# EAGLE design LeakMonitorMonitor (EAGLE 9.1.3)
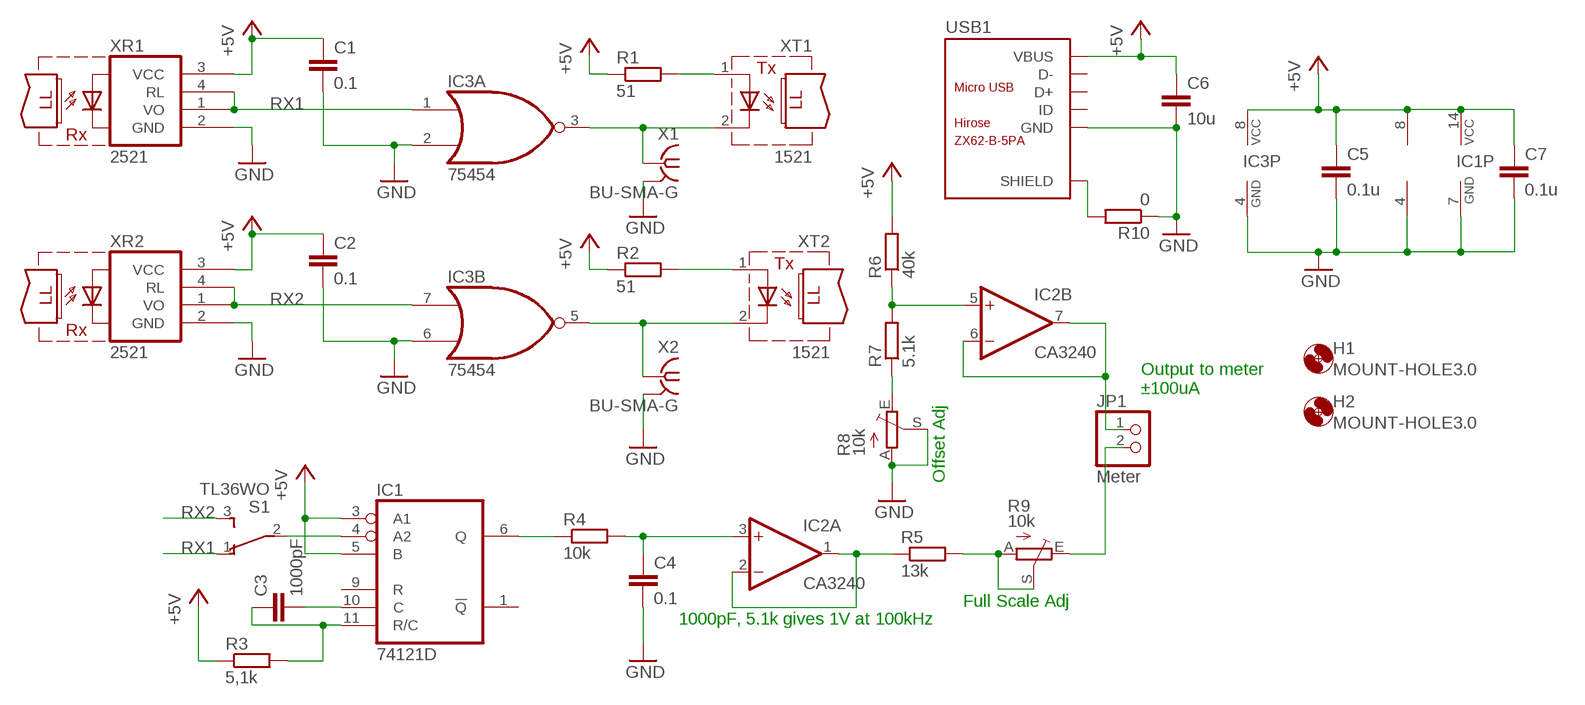
[diagram p0: schematic, sheet 1]

## Parts
C1  0.1  C-EUC0805  [C0805]
C2  0.1  C-EUC0805  [C0805]
C3  1000pF  C-EUC0805  [C0805]
C4  0.1  C-EUC0805  [C0805]
C5  0.1u  C-EUC0805  [C0805]
C6  10u  C-EUC1206  [C1206]
C7  0.1u  C-EUC0805  [C0805]
H1  MOUNT-HOLE3.0  [3,0]
H2  MOUNT-HOLE3.0  [3,0]
IC1  74121D  [SO14]
IC2  CA3240  CA3240ED  [SO08]
IC3  75454  SN75454BD  [D_R-PDSO-G8]
JP1  Meter  PINHD-1X2  [1X02]
R1  51  R-EU_M0805  [M0805]
R2  51  R-EU_M0805  [M0805]
R3  5,1k  R-EU_M0805  [M0805]
R4  10k  R-EU_M0805  [M0805]
R5  13k  R-EU_M0805  [M0805]
R6  40k  R-EU_M0805  [M0805]
R7  5.1k  R-EU_M0805  [M0805]
R8  10k  TRIM_EU-B25X  [B25X]
R9  10k  TRIM_EU-B25X  [B25X]
R10  0  R-EU_R0805  [R0805]
S1  TL36WO  [TL3XWO]
USB1  ZX62-B-5PA  MICRO-USB-SMD(ZX62-B-5PA)  [MICRO-USB5+6P-SMD-0.65-AB]
X1  BU-SMA-G  [BU-SMA-G]
X2  BU-SMA-G  [BU-SMA-G]
XR1  2521  HFBR-2521  [HFBR-15X3]
XR2  2521  HFBR-2521  [HFBR-15X3]
XT1  1521  HFBR-1521  [HFBR-15X3]
XT2  1521  HFBR-1521  [HFBR-15X3]

## Nets
+5V: C1.1 C2.1 C5.1 C6.1 C7.1 IC1.3(A1) IC1.5(B) IC1.14(VCC) IC2.8(P:V+) IC3.8(P:VCC) R1.1 R2.1 R3.1 R6.2 USB1.1(VBUS) XR1.3(VCC) XR2.3(VCC)
GND: C1.2 C2.2 C4.2 C5.2 C6.2 C7.2 IC1.7(GND) IC2.4(P:V-) IC3.2(A:I1) IC3.4(P:GND) IC3.6(B:I1) R8.A R8.S R10.1 USB1.5(GND) X1.2 X1.3 X1.4 X1.5 X2.2 X2.3 X2.4 X2.5 XR1.2(GND) XR2.2(GND)
N$1: IC3.3(A:O) X1.1 XT1.2(C)
N$2: IC2.5(B:+IN) R6.1 R7.2
N$3: R7.1 R8.E
N$4: IC3.5(B:O) X2.1 XT2.2(C)
N$5: R2.2 XT2.1(A)
N$6: R1.2 XT1.1(A)
N$7: C3.2 IC1.10(C)
N$8: IC2.1(A:OUT) IC2.2(A:-IN) R5.1
N$9: R5.2 R9.A R9.S
N$10: JP1.2 R9.E
N$11: IC2.6(B:-IN) IC2.7(B:OUT) JP1.1
N$12: C3.1 IC1.11(R/C) R3.2
N$13: IC1.6(Q) R4.1
N$14: C4.1 IC2.3(A:+IN) R4.2
N$16: IC1.4(A2) S1.2(P)
RX1: IC3.1(A:I0) S1.1(O) XR1.1(VO) XR1.4(RL)
RX2: IC3.7(B:I0) S1.3(S) XR2.1(VO) XR2.4(RL)
SHIELD: R10.2 USB1.P1(SHIELD) USB1.P2(SHIELD) USB1.P3(SHIELD) USB1.P4(SHIELD) USB1.P5(SHIELD) USB1.P6(SHIELD)
Unconnected: IC1.1(!Q) IC1.9(R) USB1.2(D-) USB1.3(D+) USB1.4(ID)

## Notes on the sheet
- Output to meter
  ±100uA
- Offset Adj
- Full Scale Adj
- 1000pF, 5.1k gives 1V at 100kHz

## Library data of the parts
C1-C7 = rcl:C-EU: CAPACITOR, European symbol; SPICEPREFIX: C
H1 H2 = holes:MOUNT-HOLE: MOUNTING HOLE with drill center marker
IC1 = 74xx-eu:74*121: Monostable MULTIVIBRATOR, schmitt trigger inputs
IC2 = linear:CA3240E: OP AMP
IC3 = texas-sn55-sn75:SN75454B: NOR PERIPHERAL DRIVERS FOR HIGH-CURRENT SWITCHING AT VERY HIGH SPEEDS Source: www.ti.com sn75452b.pdf
JP1 = pinhead:PINHD-1X2: PIN HEADER
R1-R7 R10 = rcl:R-EU_: RESISTOR, European symbol; SPICEPREFIX: R
R8 R9 = pot:TRIM_EU-: POTENTIOMETER
S1 = switch:TL36WO: TINY SWITCH ON - ON Source: http://www2.produktinfo.conrad.com/datenblaetter/700000-724999/705152-da-01-de-Subminiaturschalter_TL_36WO.pdf
USB1 = Seeed-Connector:MICRO-USB-SMD(ZX62-B-5PA): 320010005; MPN: ZX62-B-5PA
X1 X2 = con-coax:BU-SMA-G: FEMALE SMA CONNECTOR Radiall distributor RS 193-9117; OC_FARNELL: unknown; OC_NEWARK: unknown
XR1 XR2 = fiber-optic-hp:HFBR-2521: RECEIVER 5-MBd high performance link, horizontal; MF: AGILENT TECHNOLOGIES; MPN: HFBR-2521; OC_FARNELL: 1173131; OC_NEWARK: 06F6091
XT1 XT2 = fiber-optic-hp:HFBR-1521: TRANSMITTER low cost miniature fiber optic component, 5-MBd high performance link, vertical; MF: AGILENT TECHNOLOGIES; MPN: HFBR-1521; OC_FARNELL: 1173128; OC_NEWARK: 06F6050

## Net classes
0 default: width 0.305 mm

## Board
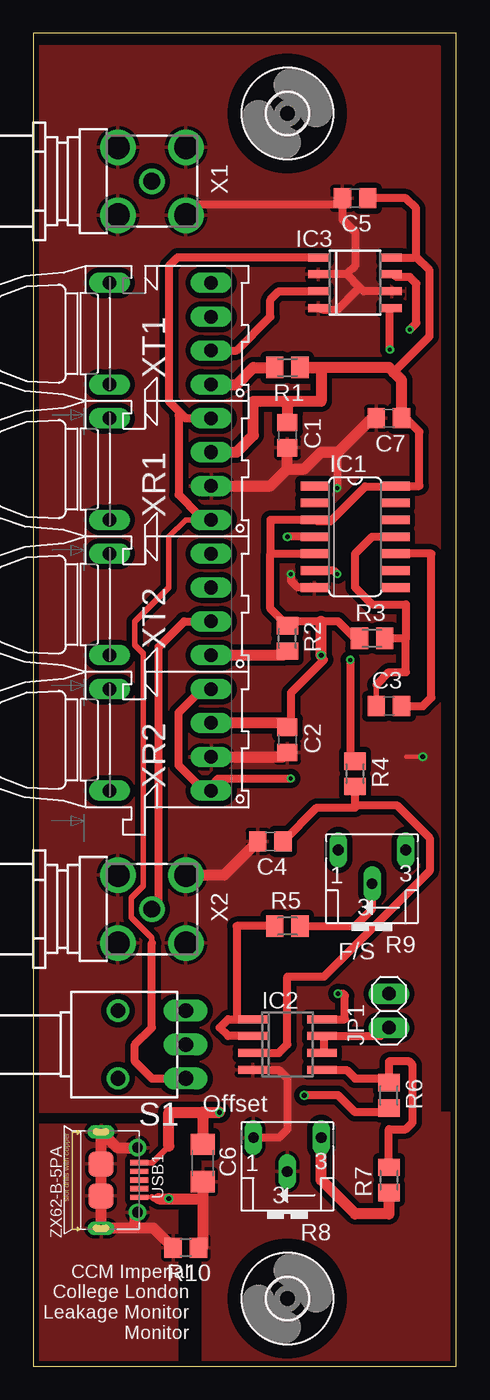
[diagram p1: board, top side]
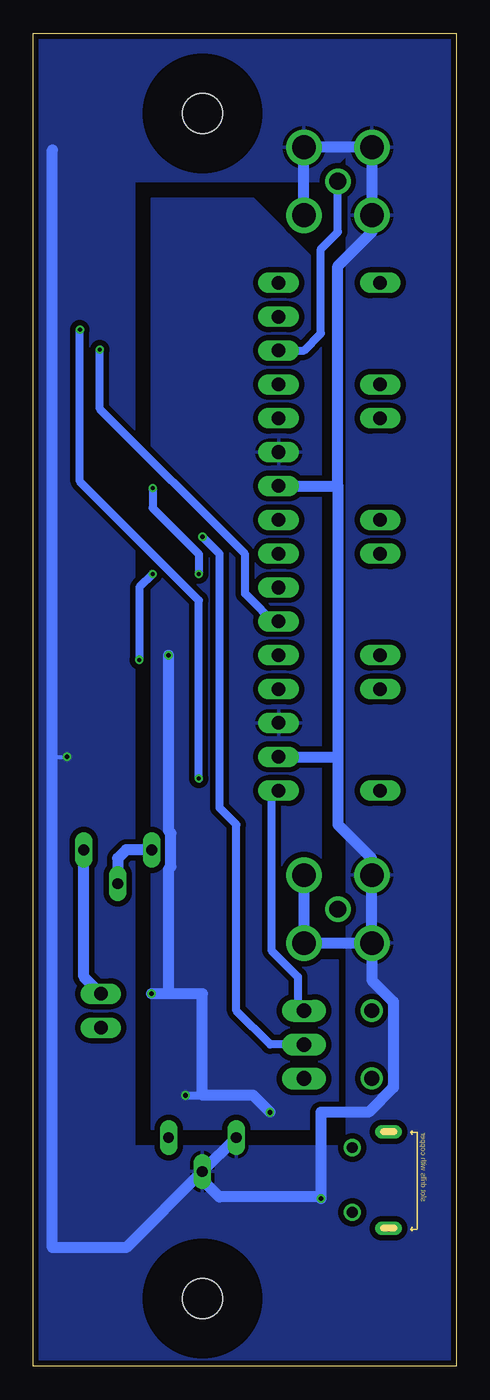
[diagram p2: board, bottom side, seen from below]

Size 31.73 x 100 mm. Coordinates in mm from the lower left corner, seen from the top.
Outline: 0,0 31.73,0 31.73,100 0,100 0,0
Copper layers (1*16): Top 0.035mm / dielectric 1.5mm / Bottom 0.035mm
Design rules "dirt_cheap_dirty_boards.v1 *": minimum track width 12mil, minimum drill 12mil, track to track 15mil, track to pad 15mil, pad to pad 5mil, via to via 5mil, smd to smd 0mil, copper to edge 10mil, drill to drill 10mil, minimum pad ring 10mil, minimum via ring 6mil, stop-mask expansion 2mil, vias tented up to drill 25mil, thermal gap 10mil

### Footprints (pad centres in the part's own frame; a part is rotated, then mirrored left to right if it is on the bottom)
C0805 = smd 1.3 x 1.5: 1 -0.95,0; 2 0.95,0
C1206 = smd 1.6 x 1.8: 1 -1.4,0; 2 1.4,0
3,0 = hole 3: 0,0
SO14 = smd 0.66 x 2.032: 1 -3.81,-3.073; 2 -2.54,-3.073; 3 -1.27,-3.073; 4 0,-3.073; 5 1.27,-3.073; 6 2.54,-3.073; 7 3.81,-3.073; 8 3.81,3.073; 9 2.54,3.073; 10 1.27,3.073; 11 0,3.073; 12 -1.27,3.073; 13 -2.54,3.073; 14 -3.81,3.073
SO08 = smd 0.6 x 2.2: 1 -1.905,-2.6; 2 -0.635,-2.6; 3 0.635,-2.6; 4 1.905,-2.6; 5 1.905,2.6; 6 0.635,2.6; 7 -0.635,2.6; 8 -1.905,2.6
D_R-PDSO-G8 = smd 0.6 x 1.5: 1 -1.905,-2.75; 2 -0.635,-2.75; 3 0.635,-2.75; 4 1.905,-2.75; 5 1.905,2.75; 6 0.635,2.75; 7 -0.635,2.75; 8 -1.905,2.75
1X02 = drill 1.016 long: 1 -1.27,0; 2 1.27,0
M0805 = smd 1.3 x 1.6: 1 -0.95,0; 2 0.95,0
B25X = drill 0.813 long: A 2.54,-1.905; E -2.54,-1.905; S 0,0.635
R0805 = smd 1.3 x 1.5: 1 -0.95,0; 2 0.95,0
TL3XWO = drill 1.1 pad 1.422 long: 1 -2.54,-5.08; 2 0,-5.08; 3 2.54,-5.08 | drill 1.1 pad 1.676: M1 -2.54,0; M2 2.54,0
MICRO-USB5+6P-SMD-0.65-AB = smd 0.4 x 1.35: 1 -1.3,2.875; 2 -0.65,2.875; 3 0,2.875; 4 0.65,2.875; 5 1.3,2.875 | smd 1.9 x 1.9: P1 -1.2,0; P2 1.2,0 | drill 0.508 pad 1.016 long: P3 -3.625,0; P4 3.625,0 | drill 0.8: P5 -2.425,2.73; P6 2.425,2.73
BU-SMA-G = drill 1.27: 1 0,0 | drill 1.778: 2 -2.55,2.55; 3 2.55,2.55; 4 2.55,-2.55; 5 -2.55,-2.55
HFBR-15X3 = drill 1.016 long: 1 3.81,9.525; 2 1.27,9.525; 3 -1.27,9.525; 4 -3.81,9.525; 5 -3.81,1.905; 8 3.81,1.905

### Placement (x,y rotation side)
C1  19.05,69.85 270 top
C2  19.05,46.99 270 top
C3  26.67,49.53 0 top
C4  17.78,39.37 180 top
C5  24.13,87.63 180 top
C6  12.7,15.24 270 top
C7  26.67,71.12 180 top
H1  19.05,5.08 0 top
H2  19.05,93.98 0 top
IC1  24.13,62.23 270 top
IC2  19.05,24.13 270 top
IC3  24.13,81.28 270 top
JP1  26.67,26.67 90 top
R1  19.05,74.93 180 top
R2  19.05,54.61 270 top
R3  25.4,54.61 0 top
R4  24.13,44.45 270 top
R5  19.05,33.02 0 top
R6  26.67,20.32 270 top
R7  26.67,13.97 90 top
R8  19.05,15.24 180 top
R9  25.4,36.83 180 top
R10  11.43,8.89 180 top
S1  6.35,24.13 90 top
USB1  5.08,13.97 270 top
X1  8.89,88.9 180 top
X2  8.89,34.29 180 top
XR1  3.81,67.31 270 top
XR2  3.81,46.99 270 top
XT1  3.81,77.47 270 top
XT2  3.81,57.15 270 top

### Tracks (layer width: path | path; a pad name or v marks a point on that pad's centre or on a via)
+5V  (via drill 0.35)
  Top 0.406: USB1.1 8.92,15.27 10.16,16.51
  Top 0.61: IC3.8 28.57,83.19 | 28.57,83.19 28.7,83.31 28.7,86.87 27.94,87.63 C5.1 | C7.1 27.94,71.12 28.96,70.1 28.96,66.04 IC1.14 27.1,66 24.89,66 22.29,63.4 21.3,63.4 IC1.3 17.78,63.5 17.78,60.96 | R3.1 24.13,54.61 22.86,55.88 21.59,55.88 19.37,55.88 R2.1 17.78,56.83 17.78,60.96 | 17.78,60.96 IC1.5 | IC2.8 23.37,26.04 23.37,27.81 23.24,27.94 v22.86,27.94 | R6.2 26.35,19.05 24.13,19.05 22.86,20.32 v20.32,20.32 | 28.57,83.19 28.73,83.21 29.72,82.22 29.72,77.27 27.24,74.79 27.03,74.57 | C2.1 19.32,48.54 19.32,50.52 21.79,53 v21.59,53.34
  Top 0.813: C2.1 19.05,48.26 XR2.3 | XR1.3 15.24,68.58 16.51,69.85 16.51,72.39 19.05,72.39 | 19.05,72.39 C1.1 | 19.05,72.39 21.59,72.39 21.59,74.93 20.32,74.93 | R1.1 20.32,74.93 | C7.1 27.62,73.98 27.03,74.57 26.67,74.93 20.32,74.93 | 10.16,16.51 10.16,19.05 12.7,19.05 | 12.7,19.05 C6.1 | 12.7,19.05 v13.97,19.05 | v21.59,53.34 21.59,55.88
  Bottom 0.61: v20.32,20.32 19.05,20.32
  Bottom 0.813: v13.97,19.05 15.24,20.32 19.05,20.32 19.05,27.94 21.59,27.94 | 21.59,27.94 v22.86,27.94 | 21.59,27.94 21.59,37.3 21.41,37.48 21.41,39.99 21.59,40.17 v21.59,53.34
  pour Bottom (isolate 0.406): 8.89,17.78 22.86,17.78 22.86,87.63 15.24,87.63 10.16,82.55 10.16,30.48 8.89,30.48
GND  (via drill 0.3, 0.35)
  Top 0.305: USB1.5 7.99,12.7 8.89,12.7 | v29.21,45.72 27.94,45.72
  Top 0.406: 8.89,12.7 9.02,12.57 9.4,12.57
  Top 0.61: IC3.6 24.77,80.64 24.47,80.94 | 23.5,81.92 IC3.2 | 24.47,80.94 23.5,81.92 | 23.5,81.92 24.13,82.55 24.13,85.09 23.18,86.04 C5.2 22.78,87.17 12.38,87.17 11.89,86.68 X1.2 | IC2.4 18.41,22.23 19.05,21.59 19.05,17.78 18.41,17.14 R8.A | IC3.4 21.79,79.25 22.78,79.25 24.27,80.73 24.47,80.94 | v19.32,59.44 19.32,58.94 19.81,58.45 20.8,58.45 IC1.7 | v22.78,65.88 22.78,68.35 22.78,68.58
  Top 0.813: C6.2 12.7,12.7 | 12.7,12.7 12.7,8.89 R10.1 | C4.2 14.29,36.83 X2.5 | XR2.2 18.73,45.72 C2.2 | XR1.2 17.78,66.04 19.05,67.31 | 19.05,67.31 C1.2 | 19.05,67.31 20.32,67.31 21.59,68.58 22.78,68.58 22.86,68.58 25.4,71.12 C7.2 | 9.4,12.57 v10.16,12.57 12.57,12.57 12.7,12.7
  Bottom 0.305: 30.31,45.72 v29.21,45.72
  Bottom 0.61: v19.32,59.44 19.32,60.92 22.78,64.39 v22.78,65.88
  Bottom 0.813: R8.S R8.A | 30.31,91.27 30.31,45.72 30.31,8.89 24.77,8.89 R8.S | X1.3 X1.4 X1.5 X1.2 | X1.3 | XR1.2 8.89,66.04 | 8.89,66.04 8.89,82.55 6.34,85.1 X1.3 | XR2.2 8.89,45.72 | 8.89,45.72 8.89,40.64 6.35,38.1 X2.4 X2.3 | X2.5 X2.2 X2.3 | 8.89,66.04 8.89,45.72 | X2.3 6.34,28.96 4.72,27.34 4.72,20.92 6.59,19.05 10.16,19.05 v10.16,12.57 10.29,12.7 17.78,12.7 19.05,13.97 R8.S
  pour Bottom (isolate 0.406): 0,0 0,99.69 8.26,99.69 8.26,0
  pour Top (isolate 0.406): 0,19.05 0,99.06 30.48,99.06 30.48,19.05
  pour Top (isolate 0.406): 12.7,19.05 31.75,19.05 31.75,0 12.7,0
  pour Bottom (isolate 0.406): 8.38,16.51 31.75,16.51 31.75,0 8.38,0
  pour Bottom (isolate 0.406): 8.26,99.69 31.75,99.69 31.75,88.9 10.16,88.9 8.26,90.81
  pour Bottom (isolate 0.406): 24.13,88.9 31.75,88.9 31.75,16.51 24.13,16.51
N$1
  Top 0.61: XT1.2 15.24,76.2 17.78,78.74 17.78,80.01 18.41,80.64 IC3.3
  Bottom 0.61: XT1.2 11.43,76.2 10.16,77.47 10.16,83.82 8.89,85.09 X1.1
N$2
  Top 0.61: R7.2 26.67,17.78 27.94,17.78 28.45,18.29 28.45,22.61 28.19,22.86 26.67,22.86 R6.1 26.35,21.59 24.13,21.59 23.5,22.23 IC2.5
N$3
  Top 0.813: R7.1 26.67,11.43 24.13,11.43 21.59,13.97 R8.E
N$4  (via drill 0.3)
  Top 0.61: XT2.2 11.3,55.88 9.4,53.98 9.4,34.8 X2.1 | v26.75,76.28 26.75,79.25 IC3.5
  Bottom 0.61: v26.75,76.28 26.75,71.82 15.85,60.92 15.85,57.95 13.37,55.47 XT2.2
N$5
  Top 0.813: R2.2 18.73,53.34 XT2.1
N$6
  Top 0.813: XT1.1 15.24,73.66 16.51,74.93 R1.2
N$7
  Top 0.61: C3.2 29.21,49.53 29.84,50.16 29.84,60.96 IC1.10
N$8
  Top 0.61: IC2.2 14.61,24.77 13.97,25.4 14.61,26.04 15.24,26.04 | 15.24,26.04 IC2.1 | R5.1 15.24,33.02 15.24,26.04
N$9
  Top 0.61: R5.2 24.13,33.02 25.4,34.29 R9.S
  Bottom 0.813: R9.A 24.77,38.73 25.4,38.1 R9.S
N$10
  Bottom 0.813: JP1.2 27.94,29.21 R9.E
N$11
  Top 0.61: IC2.7 21.79,24.77 | 21.79,24.77 26.04,24.77 JP1.1 | 21.79,24.77 21.79,23.77 IC2.6
N$12
  Top 0.406: 25.72,51.12 C3.1
  Top 0.61: IC1.11 25.4,62.23 24.13,60.96 24.13,58.42 25.4,57.15 27.94,57.15 27.94,54.61 | 27.94,54.61 R3.2 | 25.72,51.12 26.67,52.07 27.94,52.07 27.94,54.61
N$13  (via drill 0.3)
  Top 0.61: v23.77,53 23.77,45.57 R4.1 | v22.78,59.44 22.53,59.69 IC1.6
  Bottom 0.61: v23.77,53 23.77,58.45 v22.78,59.44
N$14
  Top 0.61: IC2.3 18.41,23.5 19.05,24.13 19.05,29.21 19.32,29.22 21.79,29.22 29.72,37.15 29.72,39.62 27.24,42.1 24.27,42.1 24.13,41.91 | C4.1 21.27,41.91 24.13,41.91 | 24.13,41.91 R4.2
N$16  (via drill 0.35)
  Top 0.61: IC1.4 v19.05,62.23
  Bottom 0.61: S1.2 13.97,24.13 16.51,26.67 16.51,40.64 17.78,41.91 17.78,60.96 v19.05,62.23
RX1
  Top 0.406: 8.89,31.75 8.89,32.12 7.35,33.65 7.35,35.14 8.26,36.05 8.26,53.46 7.62,54.1 7.62,55.88 10.16,58.42 10.16,62.23 11.43,63.5 XR1.1
  Top 0.61: IC3.1 10.79,83.19 10.16,82.55 10.16,72.39 11.06,71.49 | 11.06,71.49 11.43,71.12 XR1.4 | XR1.1 12.88,63.89 12.38,63.89 10.9,65.38 10.9,71.32 11.06,71.49 | 8.89,31.75 8.89,25.4 7.62,24.13 7.62,22.86 8.89,21.59 S1.1
RX2  (via drill 0.3)
  Top 0.61: v28.23,77.76 28.73,78.26 28.73,81.23 28.23,81.72 27.24,81.72 IC3.7 | v19.32,44.08 13.87,44.08 13.37,43.59 XR2.1 12.88,43.09 10.9,45.07 10.9,49.03 12.38,50.52 12.88,50.52 XR2.4
  Bottom 0.61: v28.23,77.76 28.23,66.37 19.32,57.45 v19.32,44.08 | S1.3 11.89,26.75 11.89,29.22 13.87,31.2 13.87,42.6 13.37,43.09 XR2.1
SHIELD
  Top 0.813: R10.2 9.03,10.35 7.62,10.35 | 7.62,10.35 USB1.P4 USB1.P2 USB1.P1 USB1.P3 6.28,16.39 USB1.P5 | USB1.P6 7.62,11.36 7.62,10.35
  pour Top (isolate 0.406): 0,0 0,18.16 9.78,18.16 10.79,17.14 10.79,0

### Text on the board
tNames: F/S | Offset | CCM Imperial / College London / Leakage Monitor / Monitor